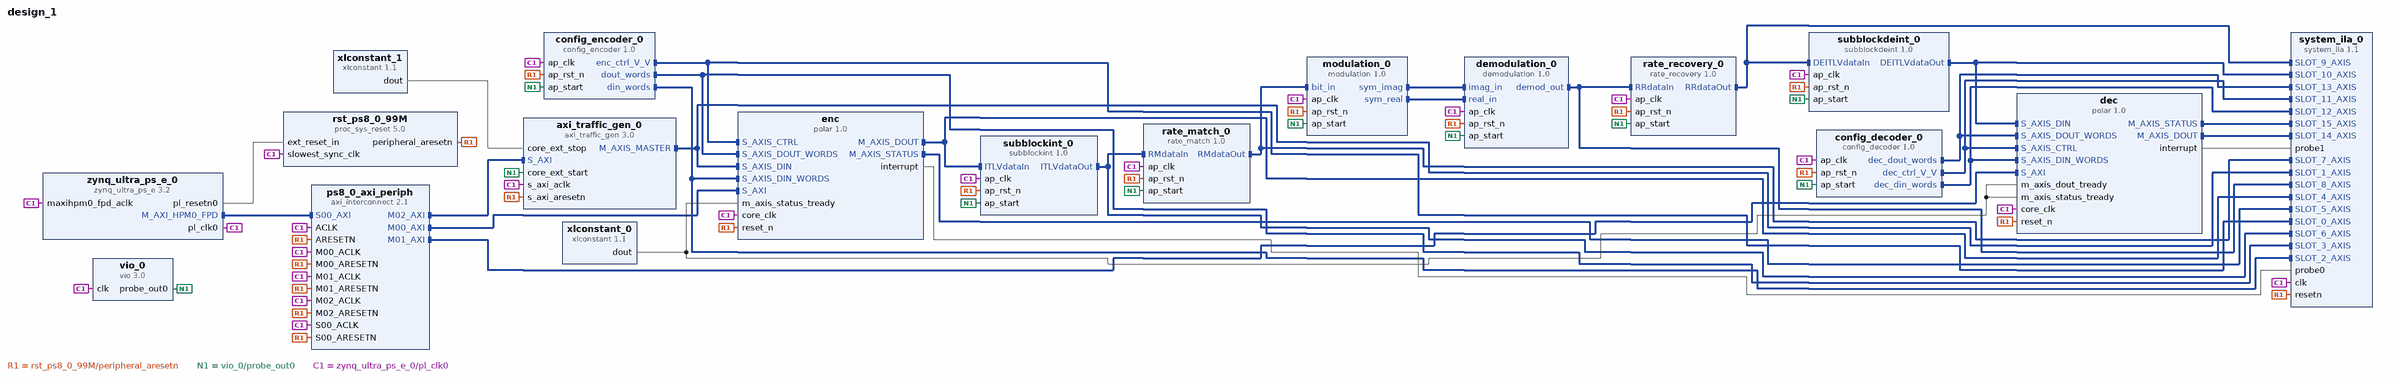
[diagram p0: block diagram of the top level]
# Vivado block design design_1, xczu21dr-ffvd1156-2-e, Vivado 2018.3
create_bd_design design_1

create_bd_cell -type ip -vlnv xilinx.com:ip:axi_interconnect:2.1 ps8_0_axi_periph
set_property -dict {CONFIG.NUM_MI 3} [get_bd_cells ps8_0_axi_periph]
create_bd_cell -type ip -vlnv xilinx.com:ip:proc_sys_reset:5.0 rst_ps8_0_99M
create_bd_cell -type ip -vlnv xilinx.com:ip:system_ila:1.1 system_ila_0
set_property -dict [list \
  CONFIG.C_DATA_DEPTH 16384 \
  CONFIG.C_MON_TYPE MIX \
  CONFIG.C_NUM_MONITOR_SLOTS 16 \
  CONFIG.C_NUM_OF_PROBES 2 \
  CONFIG.C_SLOT 15 \
  CONFIG.C_SLOT_0_INTF_TYPE xilinx.com:interface:axis_rtl:1.0 \
  CONFIG.C_SLOT_10_INTF_TYPE xilinx.com:interface:axis_rtl:1.0 \
  CONFIG.C_SLOT_11_INTF_TYPE xilinx.com:interface:axis_rtl:1.0 \
  CONFIG.C_SLOT_12_INTF_TYPE xilinx.com:interface:axis_rtl:1.0 \
  CONFIG.C_SLOT_13_INTF_TYPE xilinx.com:interface:axis_rtl:1.0 \
  CONFIG.C_SLOT_14_INTF_TYPE xilinx.com:interface:axis_rtl:1.0 \
  CONFIG.C_SLOT_15_INTF_TYPE xilinx.com:interface:axis_rtl:1.0 \
  CONFIG.C_SLOT_1_INTF_TYPE xilinx.com:interface:axis_rtl:1.0 \
  CONFIG.C_SLOT_2_INTF_TYPE xilinx.com:interface:axis_rtl:1.0 \
  CONFIG.C_SLOT_3_INTF_TYPE xilinx.com:interface:axis_rtl:1.0 \
  CONFIG.C_SLOT_4_INTF_TYPE xilinx.com:interface:axis_rtl:1.0 \
  CONFIG.C_SLOT_5_INTF_TYPE xilinx.com:interface:axis_rtl:1.0 \
  CONFIG.C_SLOT_6_INTF_TYPE xilinx.com:interface:axis_rtl:1.0 \
  CONFIG.C_SLOT_7_INTF_TYPE xilinx.com:interface:axis_rtl:1.0 \
  CONFIG.C_SLOT_8_INTF_TYPE xilinx.com:interface:axis_rtl:1.0 \
  CONFIG.C_SLOT_9_INTF_TYPE xilinx.com:interface:axis_rtl:1.0 \
] [get_bd_cells system_ila_0]
create_bd_cell -type ip -vlnv xilinx.com:ip:xlconstant:1.1 xlconstant_0
create_bd_cell -type ip -vlnv xilinx.com:hls:config_encoder:1.0 config_encoder_0
create_bd_cell -type ip -vlnv xilinx.com:ip:axi_traffic_gen:3.0 axi_traffic_gen_0
set_property -dict {CONFIG.C_ATG_MODE AXI4-Stream CONFIG.C_ATG_STREAMING_MAX_LEN_BITS 1} [get_bd_cells axi_traffic_gen_0]
create_bd_cell -type ip -vlnv xilinx.com:hls:subblockint:1.0 subblockint_0
create_bd_cell -type ip -vlnv xilinx.com:hls:modulation:1.0 modulation_0
create_bd_cell -type ip -vlnv xilinx.com:ip:polar:1.0 enc
set_property -dict {CONFIG.Operation Encode} [get_bd_cells enc]
create_bd_cell -type ip -vlnv xilinx.com:hls:rate_match:1.0 rate_match_0
create_bd_cell -type ip -vlnv xilinx.com:ip:vio:3.0 vio_0
set_property -dict {CONFIG.C_NUM_PROBE_IN 0} [get_bd_cells vio_0]
create_bd_cell -type ip -vlnv xilinx.com:ip:xlconstant:1.1 xlconstant_1
set_property -dict {CONFIG.CONST_VAL 0} [get_bd_cells xlconstant_1]
create_bd_cell -type ip -vlnv xilinx.com:hls:rate_recovery:1.0 rate_recovery_0
create_bd_cell -type ip -vlnv xilinx.com:hls:demodulation:1.0 demodulation_0
create_bd_cell -type ip -vlnv xilinx.com:hls:config_decoder:1.0 config_decoder_0
create_bd_cell -type ip -vlnv xilinx.com:hls:subblockdeint:1.0 subblockdeint_0
create_bd_cell -type ip -vlnv xilinx.com:ip:polar:1.0 dec
create_bd_cell -type ip -vlnv xilinx.com:ip:zynq_ultra_ps_e:3.2 zynq_ultra_ps_e_0
set_property -dict [list \
  CONFIG.PSU_BANK_0_IO_STANDARD LVCMOS18 \
  CONFIG.PSU_BANK_3_IO_STANDARD LVCMOS18 \
  CONFIG.PSU__CRF_APB__DDR_CTRL__FREQMHZ 1067 \
  CONFIG.PSU__CRF_APB__DPDMA_REF_CTRL__SRCSEL APLL \
  CONFIG.PSU__CRF_APB__GDMA_REF_CTRL__SRCSEL APLL \
  CONFIG.PSU__CRF_APB__GPU_REF_CTRL__SRCSEL IOPLL \
  CONFIG.PSU__DDRC__COMPONENTS UDIMM \
  CONFIG.PSU__DDRC__DEVICE_CAPACITY {8192 MBits} \
  CONFIG.PSU__DDRC__DRAM_WIDTH {16 Bits} \
  CONFIG.PSU__DDRC__SPEED_BIN DDR4_2133P \
  CONFIG.PSU__DDR_HIGH_ADDRESS_GUI_ENABLE 1 \
  CONFIG.PSU__DDR__INTERFACE__FREQMHZ 533.500 \
  CONFIG.PSU__MAXIGP0__DATA_WIDTH 128 \
  CONFIG.PSU__UART0__BAUD_RATE 115200 \
  CONFIG.PSU__UART0__MODEM__ENABLE 0 \
  CONFIG.PSU__UART0__PERIPHERAL__ENABLE 1 \
  CONFIG.PSU__UART0__PERIPHERAL__IO {MIO 26 .. 27} \
  CONFIG.PSU__USE__M_AXI_GP0 1 \
  CONFIG.PSU__USE__M_AXI_GP2 0 \
  CONFIG.SUBPRESET1 Custom \
] [get_bd_cells zynq_ultra_ps_e_0]
# 38 more settings of zynq_ultra_ps_e_0 are not shown: defaults, MIO pin electricals, DDR timing, and values the tool derives

# ---- connections ----

connect_bd_intf_net [get_bd_intf_pins rate_match_0/RMdataOut] [get_bd_intf_pins modulation_0/bit_in]
connect_bd_intf_net [get_bd_intf_pins rate_match_0/RMdataOut] [get_bd_intf_pins system_ila_0/SLOT_7_AXIS]
connect_bd_intf_net -intf_net traffic_gen_0_data_gen [get_bd_intf_pins enc/S_AXIS_DIN] [get_bd_intf_pins axi_traffic_gen_0/M_AXIS_MASTER]
connect_bd_intf_net [get_bd_intf_pins enc/S_AXIS_DIN] [get_bd_intf_pins system_ila_0/SLOT_1_AXIS]
connect_bd_intf_net [get_bd_intf_pins axi_traffic_gen_0/S_AXI] [get_bd_intf_pins ps8_0_axi_periph/M02_AXI]
connect_bd_intf_net [get_bd_intf_pins enc/M_AXIS_DOUT] [get_bd_intf_pins subblockint_0/ITLVdataIn]
connect_bd_intf_net [get_bd_intf_pins enc/M_AXIS_DOUT] [get_bd_intf_pins system_ila_0/SLOT_4_AXIS]
connect_bd_intf_net [get_bd_intf_pins subblockdeint_0/DEITLVdataIn] [get_bd_intf_pins rate_recovery_0/RRdataOut]
connect_bd_intf_net [get_bd_intf_pins subblockdeint_0/DEITLVdataIn] [get_bd_intf_pins system_ila_0/SLOT_9_AXIS]
connect_bd_intf_net [get_bd_intf_pins dec/S_AXIS_DOUT_WORDS] [get_bd_intf_pins config_decoder_0/dec_dout_words]
connect_bd_intf_net [get_bd_intf_pins dec/S_AXIS_DOUT_WORDS] [get_bd_intf_pins system_ila_0/SLOT_13_AXIS]
connect_bd_intf_net [get_bd_intf_pins enc/M_AXIS_STATUS] [get_bd_intf_pins system_ila_0/SLOT_5_AXIS]
connect_bd_intf_net [get_bd_intf_pins dec/M_AXIS_STATUS] [get_bd_intf_pins system_ila_0/SLOT_15_AXIS]
connect_bd_intf_net [get_bd_intf_pins enc/S_AXIS_CTRL] [get_bd_intf_pins config_encoder_0/enc_ctrl_V_V]
connect_bd_intf_net [get_bd_intf_pins enc/S_AXIS_CTRL] [get_bd_intf_pins system_ila_0/SLOT_0_AXIS]
connect_bd_intf_net [get_bd_intf_pins rate_match_0/RMdataIn] [get_bd_intf_pins subblockint_0/ITLVdataOut]
connect_bd_intf_net [get_bd_intf_pins rate_match_0/RMdataIn] [get_bd_intf_pins system_ila_0/SLOT_6_AXIS]
connect_bd_intf_net [get_bd_intf_pins dec/S_AXIS_DIN] [get_bd_intf_pins subblockdeint_0/DEITLVdataOut]
connect_bd_intf_net [get_bd_intf_pins dec/S_AXIS_DIN] [get_bd_intf_pins system_ila_0/SLOT_10_AXIS]
connect_bd_intf_net [get_bd_intf_pins dec/M_AXIS_DOUT] [get_bd_intf_pins system_ila_0/SLOT_14_AXIS]
connect_bd_intf_net [get_bd_intf_pins dec/S_AXIS_CTRL] [get_bd_intf_pins config_decoder_0/dec_ctrl_V_V]
connect_bd_intf_net [get_bd_intf_pins dec/S_AXIS_CTRL] [get_bd_intf_pins system_ila_0/SLOT_11_AXIS]
connect_bd_intf_net [get_bd_intf_pins enc/S_AXIS_DOUT_WORDS] [get_bd_intf_pins config_encoder_0/dout_words]
connect_bd_intf_net [get_bd_intf_pins enc/S_AXIS_DOUT_WORDS] [get_bd_intf_pins system_ila_0/SLOT_3_AXIS]
connect_bd_intf_net [get_bd_intf_pins demodulation_0/imag_in] [get_bd_intf_pins modulation_0/sym_imag]
connect_bd_intf_net -intf_net bpsk_modulation_0_demod_data [get_bd_intf_pins demodulation_0/demod_out] [get_bd_intf_pins rate_recovery_0/RRdataIn]
connect_bd_intf_net [get_bd_intf_pins demodulation_0/demod_out] [get_bd_intf_pins system_ila_0/SLOT_8_AXIS]
connect_bd_intf_net [get_bd_intf_pins enc/S_AXI] [get_bd_intf_pins ps8_0_axi_periph/M00_AXI]
connect_bd_intf_net [get_bd_intf_pins dec/S_AXI] [get_bd_intf_pins ps8_0_axi_periph/M01_AXI]
connect_bd_intf_net [get_bd_intf_pins dec/S_AXIS_DIN_WORDS] [get_bd_intf_pins config_decoder_0/dec_din_words]
connect_bd_intf_net [get_bd_intf_pins dec/S_AXIS_DIN_WORDS] [get_bd_intf_pins system_ila_0/SLOT_12_AXIS]
connect_bd_intf_net [get_bd_intf_pins demodulation_0/real_in] [get_bd_intf_pins modulation_0/sym_real]
connect_bd_intf_net [get_bd_intf_pins enc/S_AXIS_DIN_WORDS] [get_bd_intf_pins config_encoder_0/din_words]
connect_bd_intf_net [get_bd_intf_pins enc/S_AXIS_DIN_WORDS] [get_bd_intf_pins system_ila_0/SLOT_2_AXIS]
connect_bd_intf_net [get_bd_intf_pins zynq_ultra_ps_e_0/M_AXI_HPM0_FPD] [get_bd_intf_pins ps8_0_axi_periph/S00_AXI]
connect_bd_net [get_bd_pins dec/interrupt] [get_bd_pins system_ila_0/probe1]
connect_bd_net [get_bd_pins enc/interrupt] [get_bd_pins system_ila_0/probe0]
connect_bd_net [get_bd_pins rst_ps8_0_99M/peripheral_aresetn] \
  [get_bd_pins ps8_0_axi_periph/ARESETN] [get_bd_pins ps8_0_axi_periph/M00_ARESETN] \
  [get_bd_pins ps8_0_axi_periph/M01_ARESETN] [get_bd_pins ps8_0_axi_periph/M02_ARESETN] \
  [get_bd_pins ps8_0_axi_periph/S00_ARESETN] [get_bd_pins system_ila_0/resetn] [get_bd_pins axi_traffic_gen_0/s_axi_aresetn] \
  [get_bd_pins enc/reset_n] [get_bd_pins modulation_0/ap_rst_n] [get_bd_pins rate_match_0/ap_rst_n] \
  [get_bd_pins subblockint_0/ap_rst_n] [get_bd_pins config_encoder_0/ap_rst_n] [get_bd_pins config_decoder_0/ap_rst_n] \
  [get_bd_pins dec/reset_n] [get_bd_pins demodulation_0/ap_rst_n] [get_bd_pins subblockdeint_0/ap_rst_n] \
  [get_bd_pins rate_recovery_0/ap_rst_n]
connect_bd_net [get_bd_pins vio_0/probe_out0] \
  [get_bd_pins axi_traffic_gen_0/core_ext_start] [get_bd_pins modulation_0/ap_start] [get_bd_pins rate_match_0/ap_start] \
  [get_bd_pins subblockint_0/ap_start] [get_bd_pins config_encoder_0/ap_start] [get_bd_pins config_decoder_0/ap_start] \
  [get_bd_pins demodulation_0/ap_start] [get_bd_pins subblockdeint_0/ap_start] [get_bd_pins rate_recovery_0/ap_start]
connect_bd_net [get_bd_pins xlconstant_0/dout] \
  [get_bd_pins enc/m_axis_status_tready] [get_bd_pins dec/m_axis_dout_tready] [get_bd_pins dec/m_axis_status_tready]
connect_bd_net [get_bd_pins zynq_ultra_ps_e_0/pl_clk0] \
  [get_bd_pins ps8_0_axi_periph/ACLK] [get_bd_pins ps8_0_axi_periph/M00_ACLK] [get_bd_pins ps8_0_axi_periph/M01_ACLK] \
  [get_bd_pins ps8_0_axi_periph/M02_ACLK] [get_bd_pins ps8_0_axi_periph/S00_ACLK] \
  [get_bd_pins rst_ps8_0_99M/slowest_sync_clk] [get_bd_pins system_ila_0/clk] [get_bd_pins axi_traffic_gen_0/s_axi_aclk] \
  [get_bd_pins enc/core_clk] [get_bd_pins modulation_0/ap_clk] [get_bd_pins rate_match_0/ap_clk] \
  [get_bd_pins subblockint_0/ap_clk] [get_bd_pins vio_0/clk] [get_bd_pins config_encoder_0/ap_clk] \
  [get_bd_pins config_decoder_0/ap_clk] [get_bd_pins dec/core_clk] [get_bd_pins demodulation_0/ap_clk] \
  [get_bd_pins subblockdeint_0/ap_clk] [get_bd_pins rate_recovery_0/ap_clk] [get_bd_pins zynq_ultra_ps_e_0/maxihpm0_fpd_aclk]
connect_bd_net [get_bd_pins xlconstant_1/dout] [get_bd_pins axi_traffic_gen_0/core_ext_stop]
connect_bd_net [get_bd_pins zynq_ultra_ps_e_0/pl_resetn0] [get_bd_pins rst_ps8_0_99M/ext_reset_in]

# ---- address map ----
assign_bd_address -offset 0x00A0000000 -range 64K -target_address_space [get_bd_addr_spaces zynq_ultra_ps_e_0/Data] [get_bd_addr_segs axi_traffic_gen_0/S_AXI/Reg0]
assign_bd_address -offset 0x00A0040000 -range 256K -target_address_space [get_bd_addr_spaces zynq_ultra_ps_e_0/Data] [get_bd_addr_segs dec/S_AXI/PARAMS]
assign_bd_address -offset 0x00A0080000 -range 256K -target_address_space [get_bd_addr_spaces zynq_ultra_ps_e_0/Data] [get_bd_addr_segs enc/S_AXI/PARAMS]

validate_bd_design
save_bd_design
